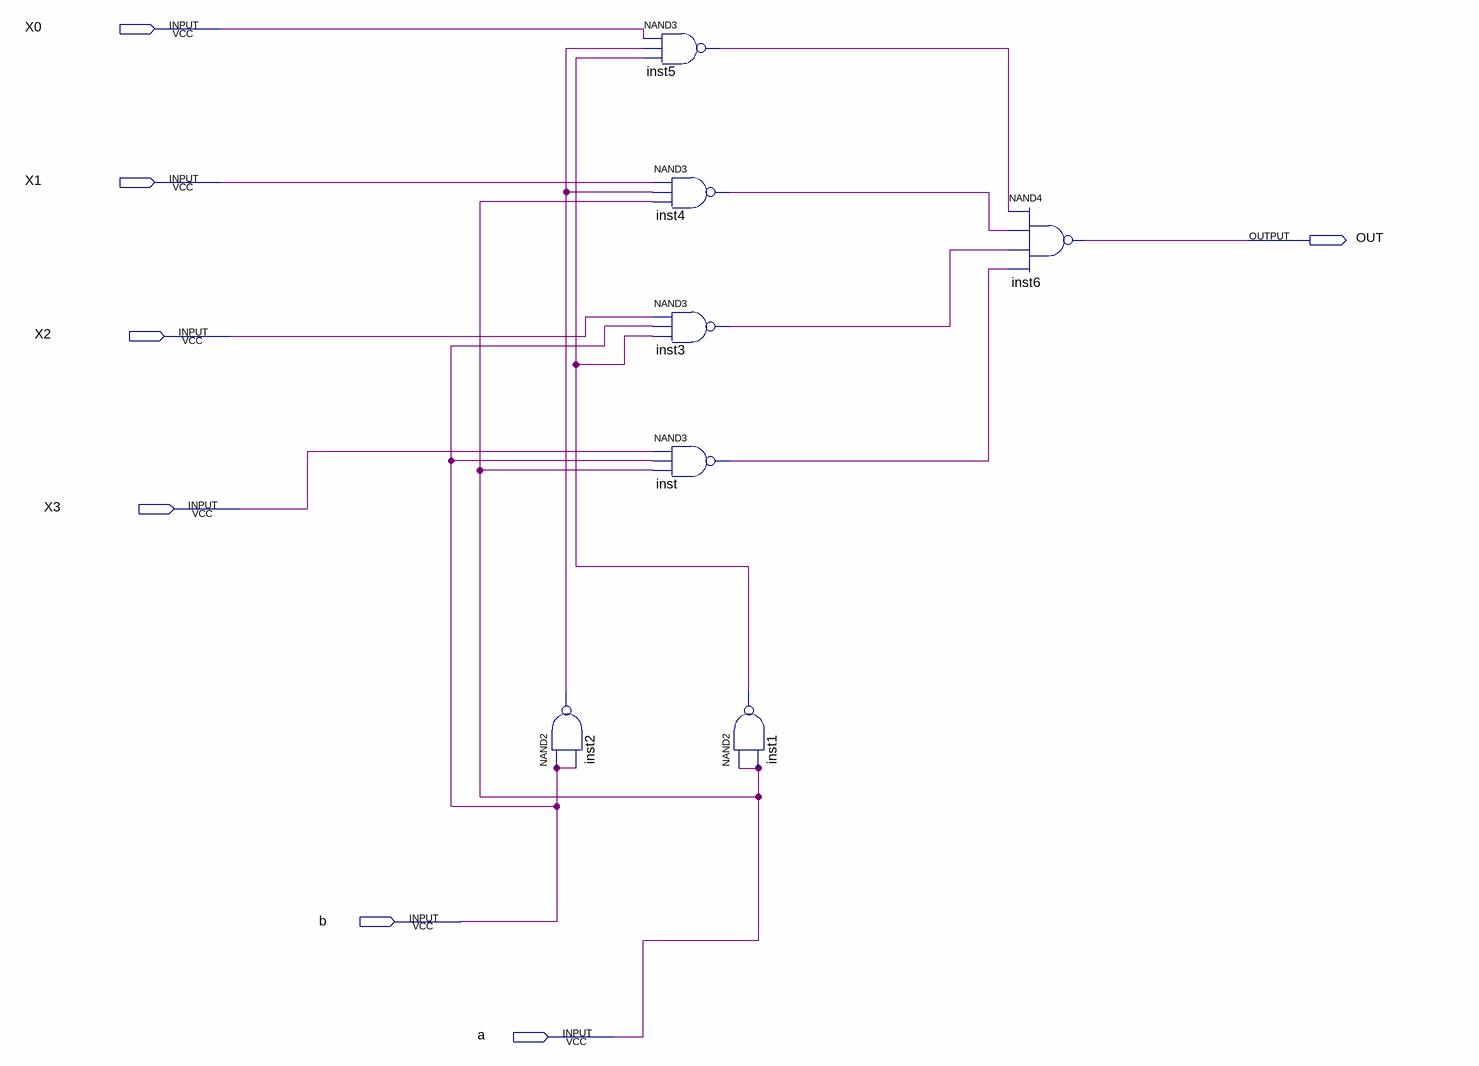
[diagram p0: schematic sheet]
// Quartus schematic MUX_four_by_one.bdf as structural Verilog: 7 symbols, 7 pins
module MUX_four_by_one (
  input  X0,
  input  X1,
  input  X2,
  input  X3,
  input  b,
  input  a,
  output OUT
);

  wire inst1_out, inst2_out, inst3_out, inst4_out, inst5_out, inst_out;

  nand inst2 (inst2_out, b, b);
  nand inst5 (inst5_out, X0, inst2_out, inst1_out);
  nand inst4 (inst4_out, X1, inst2_out, a);
  nand inst3 (inst3_out, X2, b, inst1_out);
  nand inst (inst_out, X3, b, a);
  nand inst1 (inst1_out, a, a);
  nand inst6 (OUT, inst5_out, inst4_out, inst3_out, inst_out);
endmodule
